# Altium schematic sheet STM32Lx.SchDoc: STM32L476VGT6 MCU
size A4; Date: 01-DEC-2013; Author: A.B; CompanyName: STMicroelectronics; Organization: Microcontrollers Division; Address1: 12, Rue Jules HOROWITZ; Address2: 38019 Grenoble; Address3: FRANCE; DocumentNumber: MB1184; Revision: C-01; SheetNumber: 3; SheetTotal: 10; Project: STM32L476G-DISCO
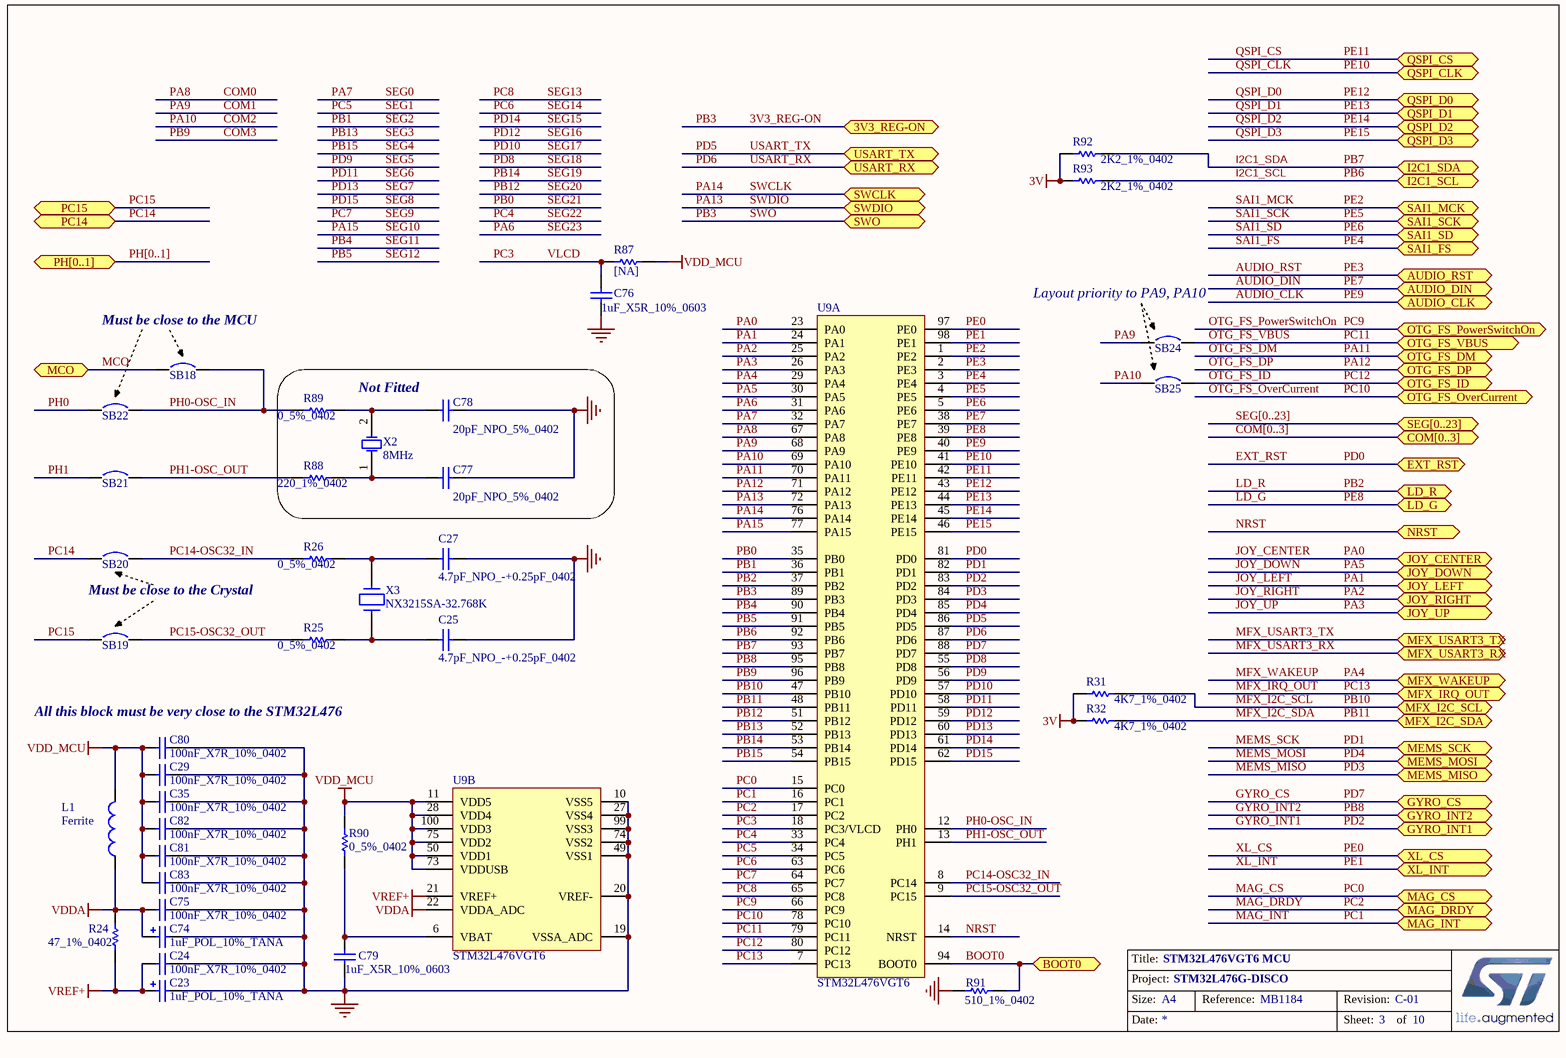
[diagram p0: STM32Lx.SchDoc]

## Parts
C23  1uF_POL_10%_TANA  [TAN-A]
C24  100nF_X7R_10%_0402  [0402C]
C25  4.7pF_NPO_-+0.25pF_0402  [0402C]
C27  4.7pF_NPO_-+0.25pF_0402  [0402C]
C29  100nF_X7R_10%_0402  [0402C]
C35  100nF_X7R_10%_0402  [0402C]
C74  1uF_POL_10%_TANA  [TAN-A]
C75  100nF_X7R_10%_0402  [0402C]
C76  1uF_X5R_10%_0603  [0603C]
C77  20pF_NPO_5%_0402  [0402C]
C78  20pF_NPO_5%_0402  [0402C]
C79  1uF_X5R_10%_0603  [0603C]
C80  100nF_X7R_10%_0402  [0402C]
C81  100nF_X7R_10%_0402  [0402C]
C82  100nF_X7R_10%_0402  [0402C]
C83  100nF_X7R_10%_0402  [0402C]
L1  Ferrite  [0603L]
R24  47_1%_0402  [0402R]
R25  0_5%_0402  [0402R]
R26  0_5%_0402  [0402R]
R31  4K7_1%_0402  [0402R]
R32  4K7_1%_0402  [0402R]
R87  [NA]  [0402R]
R88  220_1%_0402  [0402R]
R89  0_5%_0402  [0402R]
R90  0_5%_0402  [0402R]
R91  510_1%_0402  [0402R]
R92  2K2_1%_0402  [0402R]
R93  2K2_1%_0402  [0402R]
SB18  Circuit Breaker  [JP2_SMD]  (value not drawn)
SB19  Circuit Breaker  [JP2_SMD]  (value not drawn)
SB20  Circuit Breaker  [JP2_SMD]  (value not drawn)
SB21  Circuit Breaker  [JP2_SMD]  (value not drawn)
SB22  Circuit Breaker  [JP2_SMD]  (value not drawn)
SB24  Circuit Breaker  [JP2_SMD]  (value not drawn)
SB25  Circuit Breaker  [JP2_SMD]  (value not drawn)
U9  STM32L476VGT6  [TQFP100_14x14]  (parts A,B of 2)
X2  8MHz  [XTAL1]
X3  NX3215SA-32.768K  [XTAL_2SM_3R2X1R5]

## Blocks framed on the sheet
Not Fitted: C77 C78 R88 R89 X2

## Ports
3V3_REG-ON, AUDIO_CLK, AUDIO_DIN, AUDIO_RST, BOOT0, COM[0..3], EXT_RST, GYRO_CS, GYRO_INT1, GYRO_INT2, I2C1_SCL, I2C1_SDA, JOY_CENTER, JOY_DOWN, JOY_LEFT, JOY_RIGHT, JOY_UP, LD_G, LD_R, MAG_CS, MAG_DRDY, MAG_INT, MCO, MEMS_MISO, MEMS_MOSI, MEMS_SCK, MFX_I2C_SCL, MFX_I2C_SDA, MFX_IRQ_OUT, MFX_USART3_RX, MFX_USART3_TX, MFX_WAKEUP, NRST, OTG_FS_DM, OTG_FS_DP, OTG_FS_ID, OTG_FS_OverCurrent, OTG_FS_PowerSwitchOn, OTG_FS_VBUS, PC14, PC15, PH[0..1], QSPI_CLK, QSPI_CS, QSPI_D0, QSPI_D1, QSPI_D2 (bidir), QSPI_D3, SAI1_FS, SAI1_MCK, SAI1_SCK, SAI1_SD, SEG[0..23], SWCLK, SWDIO, SWO, USART_RX, USART_TX, XL_CS, XL_INT

## Nets
3V: R31.1 R32.1 R92.1 R93.1
GND: C23.2 C24.2 C25.2 C27.2 C29.2 C35.2 C74.2 C75.2 C76.1 C77.2 C78.2 C79.1 C80.2 C81.2 C82.2 C83.2 R91.1 U9.10(VSS5) U9.19(VSSA_ADC) U9.20(VREF-) U9.27(VSS4) U9.49(VSS1) U9.74(VSS2) U9.99(VSS3)
VDD_MCU: C29.1 C35.1 C80.1 C81.1 C82.1 C83.1 L1.2 R87.2 R90.2 U9.11(VDD5) U9.28(VDD4) U9.50(VDD1) U9.73(VDDUSB) U9.75(VDD2) U9.100(VDD3)
VDDA: C74.1 C75.1 L1.1 R24.2 U9.22(VDDA_ADC)
VREF+: C23.1 C24.1 R24.1 U9.21(VREF+)
3V3_REG-ON: U9.89(PB3) ; port SWO, port 3V3_REG-ON  [also labelled PB3, SWO]
AUDIO_CLK: U9.40(PE9) ; port AUDIO_CLK  [also labelled PE9]
AUDIO_DIN: U9.38(PE7) ; port AUDIO_DIN  [also labelled PE7]
AUDIO_RST: U9.2(PE3) ; port AUDIO_RST  [also labelled PE3]
BOOT0: R91.2 U9.94(BOOT0) ; port BOOT0
COM0: U9.67(PA8)  [also labelled PA8]
COM1: SB24.1 U9.68(PA9)  [also labelled PA9]
COM2: SB25.1 U9.69(PA10)  [also labelled PA10]
COM3: U9.96(PB9)  [also labelled PB9]
EXT_RST: U9.81(PD0) ; port EXT_RST  [also labelled PD0]
GYRO_CS: U9.88(PD7) ; port GYRO_CS  [also labelled PD7]
GYRO_INT1: U9.83(PD2) ; port GYRO_INT1  [also labelled PD2]
GYRO_INT2: U9.95(PB8) ; port GYRO_INT2  [also labelled PB8]
I2C1_SCL: R93.2 U9.92(PB6) ; port I2C1_SCL  [also labelled PB6]
I2C1_SDA: R92.2 U9.93(PB7) ; port I2C1_SDA  [also labelled PB7]
JOY_CENTER: U9.23(PA0) ; port JOY_CENTER  [also labelled PA0]
JOY_DOWN: U9.30(PA5) ; port JOY_DOWN  [also labelled PA5]
JOY_LEFT: U9.24(PA1) ; port JOY_LEFT  [also labelled PA1]
JOY_RIGHT: U9.25(PA2) ; port JOY_RIGHT  [also labelled PA2]
JOY_UP: U9.26(PA3) ; port JOY_UP  [also labelled PA3]
LD_G: U9.39(PE8) ; port LD_G  [also labelled PE8]
LD_R: U9.37(PB2) ; port LD_R  [also labelled PB2]
MAG_CS: U9.15(PC0) ; port MAG_CS  [also labelled PC0]
MAG_DRDY: U9.17(PC2) ; port MAG_DRDY  [also labelled PC2]
MAG_INT: U9.16(PC1) ; port MAG_INT  [also labelled PC1]
MCO: SB18.1 ; port MCO
MEMS_MISO: U9.84(PD3) ; port MEMS_MISO  [also labelled PD3]
MEMS_MOSI: U9.85(PD4) ; port MEMS_MOSI  [also labelled PD4]
MEMS_SCK: U9.82(PD1) ; port MEMS_SCK  [also labelled PD1]
MFX_I2C_SCL: R31.2 U9.47(PB10) ; port MFX_I2C_SCL  [also labelled PB10]
MFX_I2C_SDA: R32.2 U9.48(PB11) ; port MFX_I2C_SDA  [also labelled PB11]
MFX_IRQ_OUT: U9.7(PC13) ; port MFX_IRQ_OUT  [also labelled PC13]
MFX_USART3_RX: port MFX_USART3_RX
MFX_USART3_TX: port MFX_USART3_TX
MFX_WAKEUP: U9.29(PA4) ; port MFX_WAKEUP  [also labelled PA4]
NRST: U9.14(NRST) ; port NRST
OTG_FS_DM: U9.70(PA11) ; port OTG_FS_DM  [also labelled PA11]
OTG_FS_DP: U9.71(PA12) ; port OTG_FS_DP  [also labelled PA12]
OTG_FS_ID: SB25.2 U9.80(PC12) ; port OTG_FS_ID  [also labelled PC12]
OTG_FS_OverCurrent: U9.78(PC10) ; port OTG_FS_OverCurrent  [also labelled PC10]
OTG_FS_PowerSwitchOn: U9.66(PC9) ; port OTG_FS_PowerSwitchOn  [also labelled PC9]
OTG_FS_VBUS: SB24.2 U9.79(PC11) ; port OTG_FS_VBUS  [also labelled PC11]
PA6: U9.31(PA6)  [also labelled SEG23]
PA7: U9.32(PA7)  [also labelled SEG0]
PA13: U9.72(PA13) ; port SWDIO  [also labelled SWDIO]
PA14: U9.76(PA14) ; port SWCLK  [also labelled SWCLK]
PA15: U9.77(PA15)  [also labelled SEG10]
PB0: U9.35(PB0)  [also labelled SEG21]
PB1: U9.36(PB1)  [also labelled SEG2]
PB4: U9.90(PB4)  [also labelled SEG11]
PB5: U9.91(PB5)  [also labelled SEG12]
PB12: U9.51(PB12)  [also labelled SEG20]
PB13: U9.52(PB13)  [also labelled SEG3]
PB14: U9.53(PB14)  [also labelled SEG19]
PB15: U9.54(PB15)  [also labelled SEG4]
PC3: C76.2 R87.1 U9.18(PC3/VLCD)  [also labelled VLCD]
PC4: U9.33(PC4)  [also labelled SEG22]
PC5: U9.34(PC5)  [also labelled SEG1]
PC6: U9.63(PC6)  [also labelled SEG14]
PC7: U9.64(PC7)  [also labelled SEG9]
PC8: U9.65(PC8)  [also labelled SEG13]
PC14: SB20.1 ; port PC14
PC14-OSC32_IN: R26.1 SB20.2 U9.8(PC14)
PC15: SB19.1 ; port PC15
PC15-OSC32_OUT: R25.1 SB19.2 U9.9(PC15)
PD5: U9.86(PD5) ; port USART_TX  [also labelled USART_TX]
PD6: U9.87(PD6) ; port USART_RX  [also labelled USART_RX]
PD8: U9.55(PD8)  [also labelled SEG18]
PD9: U9.56(PD9)  [also labelled SEG5]
PD10: U9.57(PD10)  [also labelled SEG17]
PD11: U9.58(PD11)  [also labelled SEG6]
PD12: U9.59(PD12)  [also labelled SEG16]
PD13: U9.60(PD13)  [also labelled SEG7]
PD14: U9.61(PD14)  [also labelled SEG15]
PD15: U9.62(PD15)  [also labelled SEG8]
PE0: U9.97(PE0) ; port XL_CS  [also labelled XL_CS]
PE1: U9.98(PE1) ; port XL_INT  [also labelled XL_INT]
PE2: U9.1(PE2) ; port SAI1_MCK  [also labelled SAI1_MCK]
PE4: U9.3(PE4) ; port SAI1_FS  [also labelled SAI1_FS]
PE5: U9.4(PE5) ; port SAI1_SCK  [also labelled SAI1_SCK]
PE6: U9.5(PE6) ; port SAI1_SD  [also labelled SAI1_SD]
PE10: U9.41(PE10) ; port QSPI_CLK  [also labelled QSPI_CLK]
PE11: U9.42(PE11) ; port QSPI_CS  [also labelled QSPI_CS]
PE12: U9.43(PE12) ; port QSPI_D0  [also labelled QSPI_D0]
PE13: U9.44(PE13) ; port QSPI_D1  [also labelled QSPI_D1]
PE14: U9.45(PE14) ; port QSPI_D2  [also labelled QSPI_D2]
PE15: U9.46(PE15) ; port QSPI_D3  [also labelled QSPI_D3]
PH0: SB22.1
PH0-OSC_IN: R89.1 SB18.2 SB22.2 U9.12(PH0)
PH1: SB21.1
PH1-OSC_OUT: R88.1 SB21.2 U9.13(PH1)
NetC25_1: C25.1 R25.2 X3.2
NetC27_1: C27.1 R26.2 X3.1
NetC77_1: C77.1 R88.2 X2.1(OSC1)
NetC78_1: C78.1 R89.2 X2.2(OSC2)
NetC79_2: C79.2 R90.1 U9.6(VBAT)

## Buses and harness runs
bus COM[0..3] = port COM[0..3]
bus PH[0..1] = port PH[0..1]
bus SEG[0..23] = port SEG[0..23]

## Notes on the sheet
- (near SB24) Layout priority to PA9, PA10
- (near SB18) Must be close to the MCU
- Must be close to the Crystal
- (near C80) All this block must be very close to the STM32L476
- Title:
- Project:
- Size:
- Date:
- A4
- Reference:
- Sheet:
- Revision:
- of

## Library data of the parts
C23 C74 = Cap_1uF_POL_10%_TANA: Polarized Capacitor,1uF,16V,10%,typeA,AVX; Manuf_Part_1: TAJA105K016R; Revision: July-2002: Re-released for DXP Platform.; Value: 1uF; Manuf_1: AVX; Distrib: *; Order: TAJA105K016R; ECCN_US/EU: n/a
C24 C29 C35 C75 C80-C83 = Cap_100nF_X7R_10%_0402: Capacitor,100nF,16V,X7R,10%,0402,YAGEO; Manuf_Part_1: CC0402KRX7R7BB104; Revision: July-2002: Re-released for DXP Platform.; Value: 100nF; Order: CC0402KRX7R7BB104; Manuf_1: YAGEO; ECCN_US/EU: n/a
C25 C27 = Cap_4.7pF_NPO_-+0.25pF_0402: Capacitor, 4.7pF, 50V, NPO, -+0.25pF, 0402, YAGEO; Manuf_Part_1: CC0402CRNPO9BN4R7; Order: 311-1367-2-ND; Revision: July-2002: Re-released for DXP Platform.; Value: 4.7pF; Manuf_1: YAGEO; ECCN_US/EU: n/a; Distrib: DIGIKEY
C76 C79 = Cap_1uF_X5R_10%_0603: Capacitor,1uF,16V,X5R,10%,0603,YAGEO; Manuf_Part_1: CC0603KRX5R7BB105; Revision: July-2002: Re-released for DXP Platform.; Value: 1uF; Order: CC0603KRX5R7BB105; Manuf_1: YAGEO; ECCN_US/EU: n/a
C77 C78 = Cap_20pF_NPO_5%_0402: Capacitor,20pF,50V,NPO,5%,0402,YAGEO; Order: CC0402JRNPO9BN200; Fitted: NO; Revision: July-2002: Re-released for DXP Platform.; Value: 20pF; Manuf_1: YAGEO; Manuf_Part_1: CC0402JRNPO9BN200; ECCN_US/EU: n/a
L1 = BEAD_600R_350MA_0603: Bead,600R,350mA,0603,FCM1608KF-601T03,Tai-tech; Manuf_2: TDK; Manuf_Part_2: MPZ1608S300A; Value: 100uH; Comment_1: bead,30R,5A,0603,MPZ1608S300A,TDK; Revision: July-2002: Re-released for DXP Platform.; Manuf_Part_1: FCM1608KF-601T03; Order: FCM1608KF-601T03; Manuf_1: Tai-tech; ECCN_US/EU: n/a
R24 = Res_47_1%_0402: Resistor,47,0402,1%,YAGEO; Manuf_Part_1: RC0402FR-0747RL; Value: 47; Order: 311-47.0LRCT-ND; Manuf_1: YAGEO; ECCN_US/EU: n/a; Distrib: DIGIKEY
R25 R26 R90 = Res_0_5%_0402: Resistor,0,0402,5%,YAGEO; Manuf_Part_1: RC0402JR-070RL; Value: 0; Order: 2363467; ECCN_US/EU: n/a; Manuf_1: YAGEO; Distrib: FARNELL
R31 R32 = Res_4K7_1%_0402: Resistor,4K7,0402,1%,YAGEO; Manuf_Part_1: RT0402FRE074K7L; Value: 4K7; Manuf_1: YAGEO; Order: RT0402FRE074K7L; ECCN_US/EU: n/a
R87 = Res_NA_0402: Resistor,[NA],0402; Fitted: NO; Value: [NA]; ECCN_US/EU: n/a
R88 = Res_220_1%_0402: Resistor,220,0402,1%,YAGEO; Manuf_Part_1: RC0402FR-07220RL; Value: 220; Fitted: NO; Manuf_1: YAGEO; Order: RC0402FR-07220RL; ECCN_US/EU: n/a; Distrib: DIGIKEY
R89 = Res_0_5%_0402: Resistor,0,0402,5%,YAGEO; Manuf_Part_1: RC0402JR-070RL; Value: 0; Order: 2363467; Fitted: NO; ECCN_US/EU: n/a; Manuf_1: YAGEO; Distrib: FARNELL
R91 = Res_510_1%_0402: Resistor,510,0402,1%,YAGEO; Manuf_Part_1: RC0402FR-07510L; Value: 510; Manuf_1: YAGEO; Order: RC0402FR-07510L; ECCN_US/EU: n/a; Distrib: DIGIKEY
R92 R93 = Res_2K2_1%_0402: Resistor,2K2,0402,1%,YAGEO; Manuf_Part_1: RC0402FR-072R2L; Value: 2K2; Manuf_1: YAGEO; Order: RC0402FR-072R2L; ECCN_US/EU: n/a
SB18-SB20 SB24 SB25 = Circuit Breaker: Solder: NO; Published: 24-Mar-1999; Revision: July-2002: Re-released for DXP Platform.; Publisher: Altium Limited
SB21 SB22 = Circuit Breaker: Solder: YES; Published: 24-Mar-1999; Revision: July-2002: Re-released for DXP Platform.; Publisher: Altium Limited
U9 = STM32L476VGT6: STM32 Orca (STM32L476VGT6); Manuf_Part_1: STM32L476VGT6U; Manuf_1: STM; Provided: ST; Ref St: xxxxxxxxx; ECCN_US/EU: 3A991A2/NEC; Distrib: ST; Footprint: QFP100
X2 = XTAL: Crystal Oscillator,8Mhz,20PF,20PPM,-10-70 degree,DIP,HC-49S; Manuf_Part_1: 9SL8000020AFXHF0; ECCN_US/EU: EAR99/NEC; Fitted: NO; Order: 9SL8000020AFXHF0
X3 = XTAL_32K_NX3215SA: Crystal 32.768kHz, 6pF, -+20PPM, R=50K, SMD; Manuf_1: NDK; Manuf_Part_1: NX3215SA 32.768KHz EXS00A-MU00525; ECCN_US/EU: EAR99/NEC; Ref St: 9157034; NDK Ref: X3101802; Provided: ST; Distrib: *; Order: NX3215SA 32.768KHz EXS00A-MU00525